# EasyEDA schematic 机械时钟电源板_原理图.json
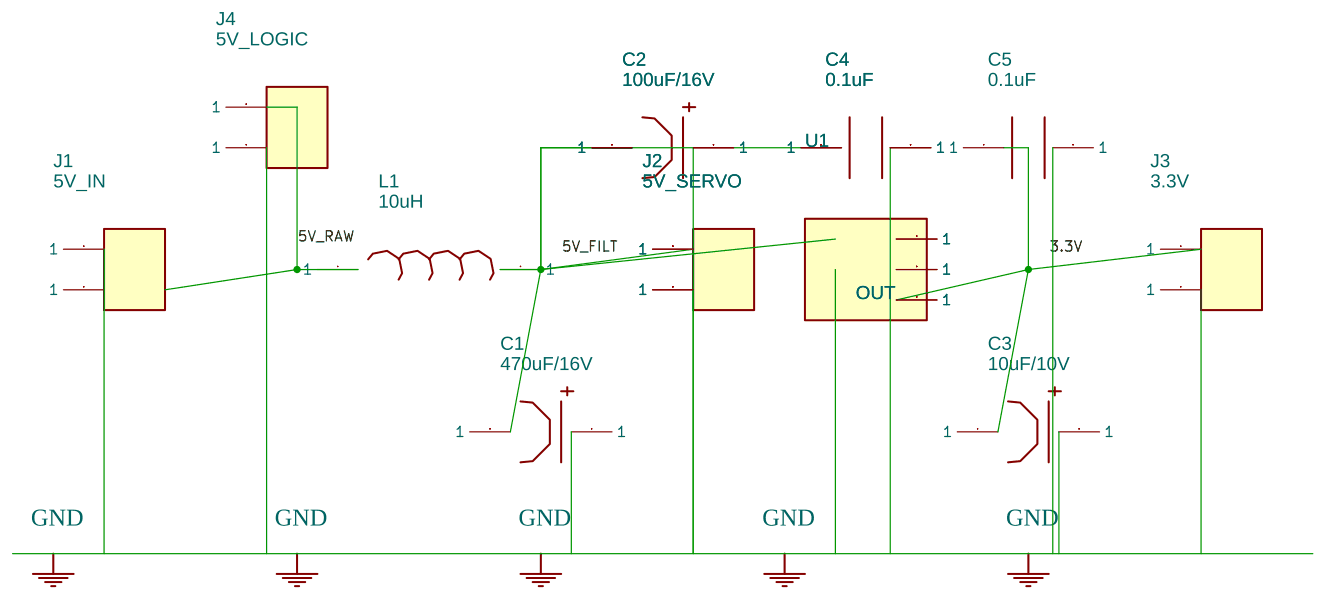
[diagram p0: schematic sheet]

## Parts
C1  470uF/16V  [CAP-DIP]
C2  100uF/16V  [CAP-DIP]
C3  10uF/10V  [CAP-DIP]
C4  0.1uF  [CAP-0805]
C5  0.1uF  [CAP-0805]
J1  5V_IN  [CONN-2]
J2  5V_SERVO  [CONN-2]
J3  3.3V  [CONN-2]
J4  5V_LOGIC  [CONN-2]
L1  10uH  [INDUCTOR]
U1  AMS1117-3.3V  [HDR-2.54-3P-F]

## Nets
5V_RAW: C1.1 C2.1 C4.1 J2.1 J4.1 L1.1
Net-(C3-1): C3.1 C5.1 J3.1 U1.1

Not connected (* = marked no-connect by the designer): J1 1
